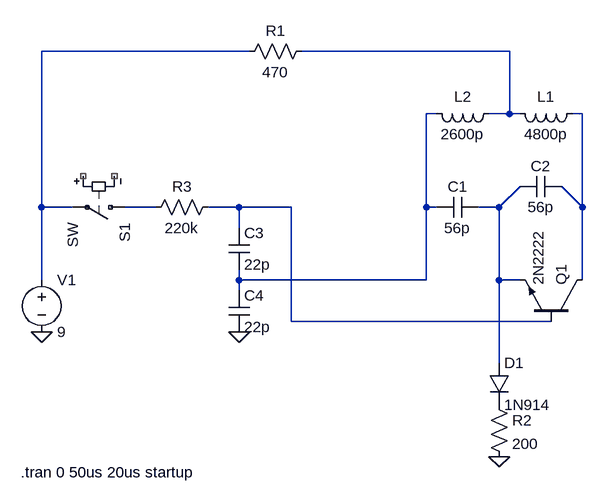
[diagram p0: schematic hunter.asc]
hunter.asc, the LTspice schematic file:
Version 4
SHEET 1 880 680
WIRE 320 -272 0 -272
WIRE 720 -272 400 -272
WIRE 608 -176 592 -176
WIRE 720 -176 720 -272
WIRE 720 -176 688 -176
WIRE 736 -176 720 -176
WIRE 832 -176 816 -176
WIRE 0 -32 0 -272
WIRE 48 -32 0 -32
WIRE 176 -32 128 -32
WIRE 304 -32 256 -32
WIRE 384 -32 304 -32
WIRE 592 -32 592 -176
WIRE 608 -32 592 -32
WIRE 704 -32 736 -64
WIRE 704 -32 672 -32
WIRE 832 -32 832 -176
WIRE 832 -32 800 -64
WIRE 304 0 304 -32
WIRE 0 80 0 -32
WIRE 304 80 304 64
WIRE 592 80 592 -32
WIRE 592 80 304 80
WIRE 704 80 704 -32
WIRE 736 80 704 80
WIRE 832 80 832 -32
WIRE 304 96 304 80
WIRE 384 144 384 -32
WIRE 784 144 384 144
WIRE 704 208 704 80
FLAG 0 160 0
FLAG 704 352 0
FLAG 304 160 0
SYMBOL voltage 0 64 R0
WINDOW 123 0 0 Left 0
WINDOW 39 0 0 Left 0
SYMATTR InstName V1
SYMATTR Value 9
SYMBOL npn 832 144 M270
SYMATTR InstName Q1
SYMATTR Value 2N2222
SYMBOL ind 832 -192 R90
WINDOW 0 5 56 VBottom 2
WINDOW 3 32 56 VTop 2
SYMATTR InstName L1
SYMATTR Value 4800p
SYMBOL ind 704 -192 R90
WINDOW 0 5 56 VBottom 2
WINDOW 3 32 56 VTop 2
SYMATTR InstName L2
SYMATTR Value 2600p
SYMBOL res 416 -288 R90
WINDOW 0 0 56 VBottom 2
WINDOW 3 32 56 VTop 2
SYMATTR InstName R1
SYMATTR Value 470
SYMBOL cap 672 -48 R90
WINDOW 0 0 32 VBottom 2
WINDOW 3 32 32 VTop 2
SYMATTR InstName C1
SYMATTR Value 56p
SYMBOL cap 800 -80 R90
WINDOW 0 0 32 VBottom 2
WINDOW 3 32 32 VTop 2
SYMATTR InstName C2
SYMATTR Value 56p
SYMBOL res 688 256 R0
SYMATTR InstName R2
SYMATTR Value 200
SYMBOL res 272 -48 R90
WINDOW 0 0 56 VBottom 2
WINDOW 3 32 56 VTop 2
SYMATTR InstName R3
SYMATTR Value 220k
SYMBOL cap 288 0 R0
SYMATTR InstName C3
SYMATTR Value 22p
SYMBOL cap 288 96 R0
SYMATTR InstName C4
SYMATTR Value 22p
SYMBOL diode 688 208 R0
SYMATTR InstName D1
SYMATTR Value 1N914
SYMATTR Description Light Emitting Diode
SYMATTR Type led
SYMBOL sw 144 -32 R90
SYMATTR InstName S1
TEXT -32 376 Left 2 !.tran 0 50us 20us startup

The netlist it stands for:
* hunter.asc
V1 N001 0 9
Q1 N004 N006 N007 0 2N2222
L1 N004 N002 4800p
L2 N002 N003 2600p
R1 N002 N001 470
C1 N007 N003 56p
C2 N004 N007 56p
R2 P001 0 200
R3 N006 N005 220k
C3 N006 N003 22p
C4 N003 0 22p
D1 N007 P001 1N914
S1 N005 N001 NC_01 NC_02 SW
.model D D
.lib standard.dio
.model NPN NPN
.model PNP PNP
.lib standard.bjt
.tran 0 50us 20us startup
.backanno
.end